# EAGLE design Standby Power (EAGLE 6.6.0)
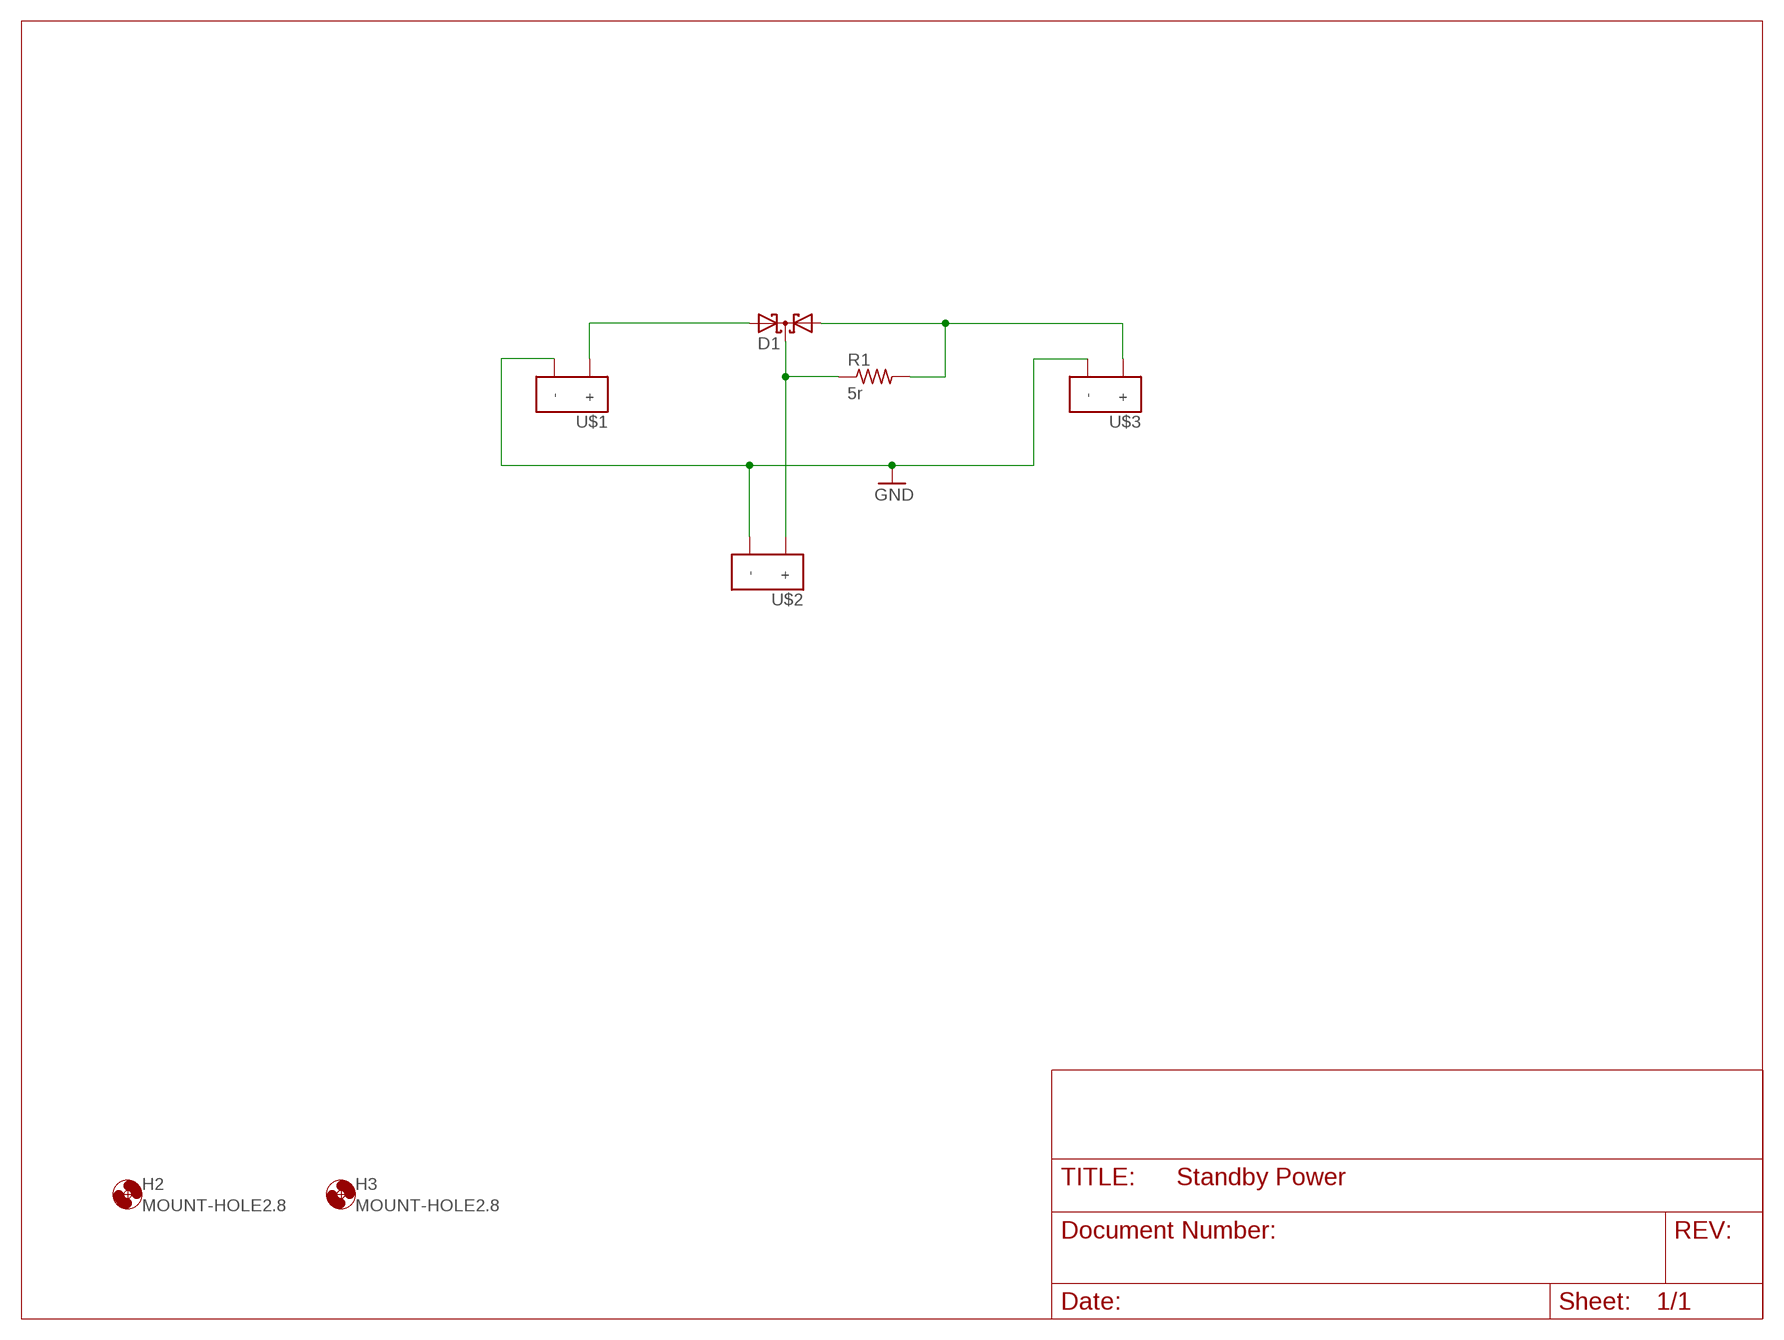
[diagram p0: schematic, sheet 1]

## Parts
D1  DIODE_2SCHOTTKY-SOT82H  [SOT82L]
H2  MOUNT-HOLE2.8  [2,8]
H3  MOUNT-HOLE2.8  [2,8]
R1  5r  R-US_V235/17  [V235/17]
U$1  POWERPOLE-HORZ-NARROW-CONTACT  [HORZ-NARROW-CONTACT]
U$2  POWERPOLE-HORZ-NARROW-CONTACT  [HORZ-NARROW-CONTACT]
U$3  POWERPOLE-HORZ-NARROW-CONTACT  [HORZ-NARROW-CONTACT]

## Nets
GND: U$1.- U$2.- U$3.-
N$1: D1.A2 U$1.+
N$2: D1.A1 R1.2 U$3.+
N$3: D1.C R1.1 U$2.+

## Library data of the parts
D1 = diode:DIODE_2SCHOTTKY-: Dual SCHOTTKY DIODE common cathode
H2 H3 = holes:MOUNT-HOLE: MOUNTING HOLE with drill center marker
R1 = resistor:R-US_: RESISTOR, American symbol
U$1-U$3 = con-powerpole:POWERPOLE-HORZ-NARROW-CONTACT

## Board
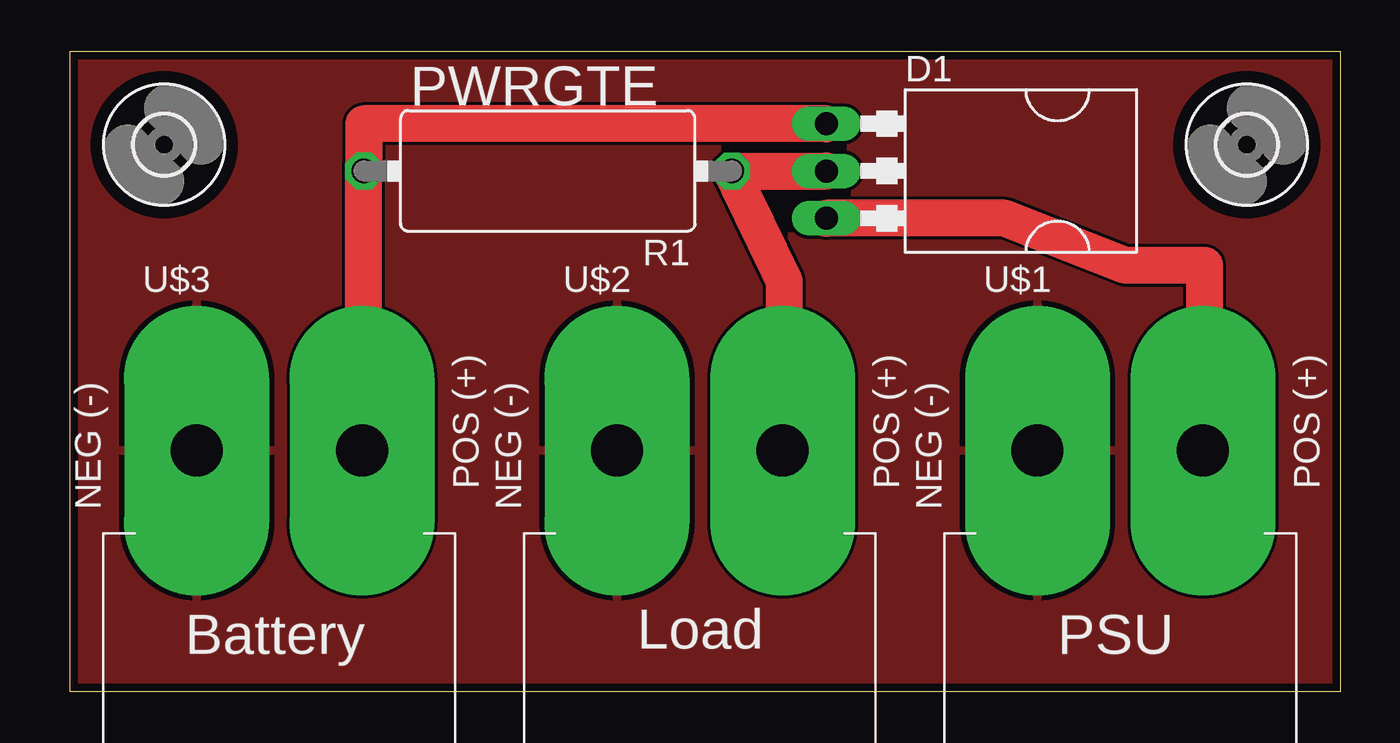
[diagram p1: board, top side]
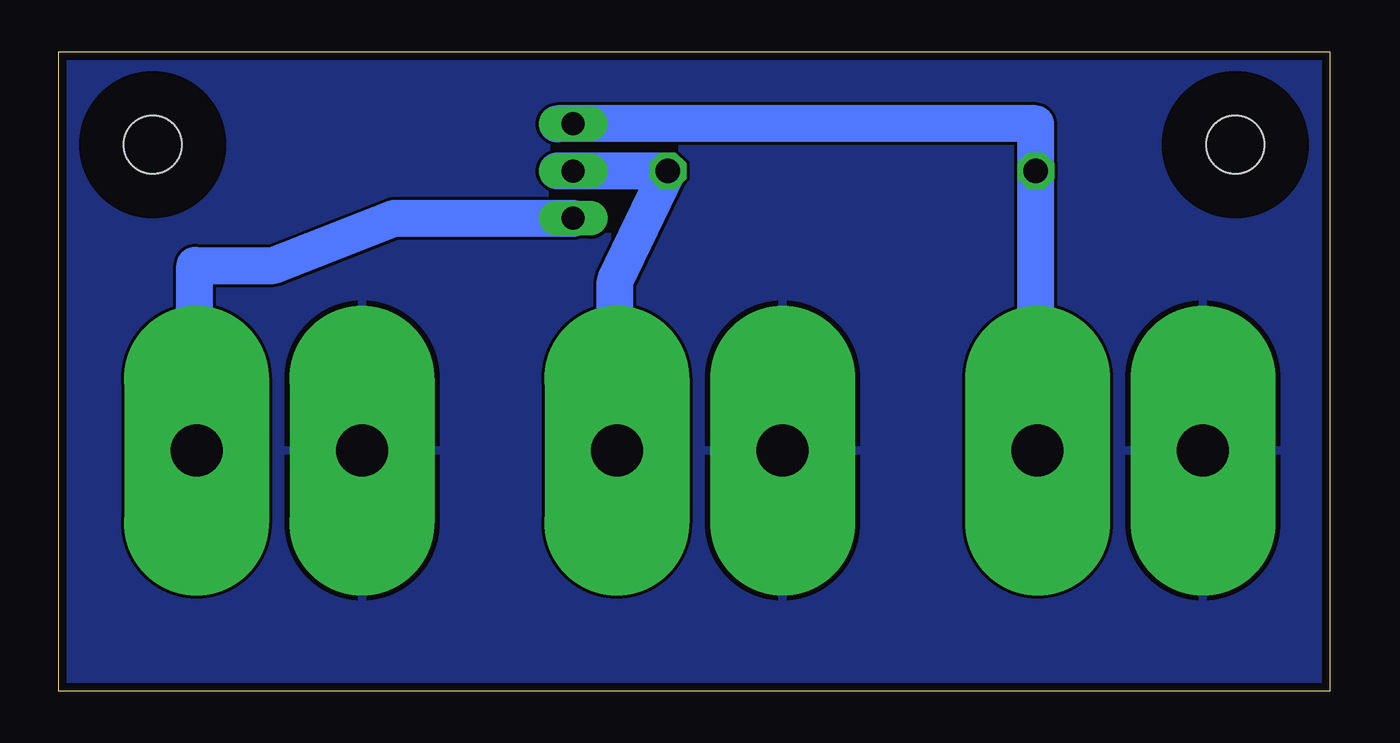
[diagram p2: board, bottom side, seen from below]

Size 61.45 x 30.91 mm. Coordinates in mm from the lower left corner, seen from the top.
Outline: 0,0 61.45,0 61.45,30.91 0,30.91 0,0
Copper layers (1*16): Top 0.0356mm / dielectric 1.5011mm / Bottom 0.0356mm
Design rules "LaenPCBOrder": minimum track width 6mil, minimum drill 13mil, track to track 6mil, track to pad 6mil, pad to pad 6mil, via to via 6mil, smd to smd 6mil, copper to edge 15mil, drill to drill 6mil, minimum pad ring 7mil, minimum via ring 7mil, stop-mask expansion 3mil, vias tented up to drill 0mil, thermal gap 10mil

### Footprints (pad centres in the part's own frame; a part is rotated, then mirrored left to right if it is on the bottom)
SOT82L = drill 1.118 long: A1 -2.286,-5.08; A2 2.286,-5.08; C 0,-5.08
2,8 = hole 2.8: 0,0
V235/17 = drill 1.194 octagon: 1 -8.89,0; 2 8.89,0
HORZ-NARROW-CONTACT = drill 2.5 pad 7 long: + -3.98,-4.01; - 4.02,-4.01

### Placement (x,y rotation side)
D1  41.66,25.15 270 top
H2  56.9,26.42 0 top
H3  4.57,26.42 0 top
R1  23.11,25.15 180 top
U$1  50.8,7.62 180 top
U$2  30.48,7.62 180 top
U$3  10.16,7.62 180 top

### Tracks (layer width: path | path; a pad name or v marks a point on that pad's centre or on a via)
GND
  pour Bottom: 0,0 61.47,0.25 61.47,31.5 0,31.24
  pour Top: 0,0 61.47,0.25 61.47,31.5 0,31.24
N$1
  Top 1.016: U$1.+ 54.86,11.63
  Top 1.778: 54.86,11.63 54.86,20.57 51.05,20.57 45.21,22.86 D1.A2
  Bottom 1.778: 54.86,11.68 54.86,20.57 51.05,20.57 45.21,22.86 D1.A2
N$2
  Top 1.27: U$3.+ 14.22,11.63
  Top 1.778: 14.22,11.63 R1.2 14.22,27.43 D1.A1
  Bottom 1.778: 14.22,11.94 R1.2 14.22,27.43 37.34,27.43
N$3
  Top 1.778: D1.C R1.1 34.54,19.81 34.54,12.9 U$2.+
  Bottom 1.778: R1.1 37.34,25.15
N$4
  Bottom 1.778: 34.54,11.94 34.54,15.49 34.54,19.81 32,25.15

### Text on the board
tPlace: PWRGTE | Battery | Load | PSU